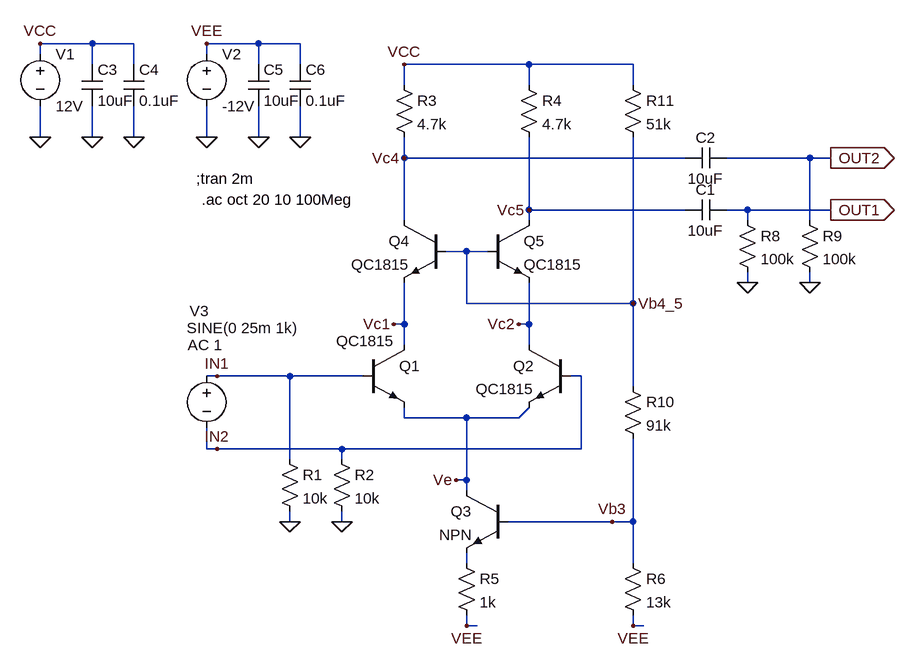
[diagram p0: schematic Diff_Amp_2SC1815_Cascode.asc]
Diff_Amp_2SC1815_Cascode.asc, the LTspice schematic file:
Version 4
SHEET 1 1076 680
WIRE -320 -352 -400 -352
WIRE -256 -352 -320 -352
WIRE -64 -352 -144 -352
WIRE 0 -352 -64 -352
WIRE -400 -336 -400 -352
WIRE -144 -336 -144 -352
WIRE -320 -320 -320 -352
WIRE -256 -320 -256 -352
WIRE -64 -320 -64 -352
WIRE 0 -320 0 -352
WIRE 352 -320 160 -320
WIRE 512 -320 352 -320
WIRE 160 -288 160 -320
WIRE 352 -288 352 -320
WIRE 512 -288 512 -320
WIRE -400 -208 -400 -256
WIRE -320 -208 -320 -256
WIRE -256 -208 -256 -256
WIRE -144 -208 -144 -256
WIRE -64 -208 -64 -256
WIRE 0 -208 0 -256
WIRE 160 -176 160 -208
WIRE 592 -176 160 -176
WIRE 784 -176 656 -176
WIRE 816 -176 784 -176
WIRE 352 -96 352 -208
WIRE 592 -96 352 -96
WIRE 688 -96 656 -96
WIRE 816 -96 688 -96
WIRE 160 -80 160 -176
WIRE 352 -80 352 -96
WIRE 688 -80 688 -96
WIRE 784 -80 784 -176
WIRE 256 -32 224 -32
WIRE 288 -32 256 -32
WIRE 688 16 688 0
WIRE 784 16 784 0
WIRE 256 48 256 -32
WIRE 512 48 512 -208
WIRE 512 48 256 48
WIRE 160 80 160 16
WIRE 160 80 144 80
WIRE 352 80 352 16
WIRE 352 80 336 80
WIRE 160 112 160 80
WIRE 352 112 352 80
WIRE -128 160 -144 160
WIRE -16 160 -128 160
WIRE 96 160 -16 160
WIRE 432 160 416 160
WIRE 512 176 512 48
WIRE 160 224 160 208
WIRE 256 224 160 224
WIRE 336 224 352 208
WIRE 336 224 256 224
WIRE -144 272 -144 240
WIRE -128 272 -144 272
WIRE 64 272 -128 272
WIRE 432 272 432 160
WIRE 432 272 64 272
WIRE -16 288 -16 160
WIRE 64 288 64 272
WIRE 256 320 256 224
WIRE 256 320 240 320
WIRE 256 336 256 320
WIRE -16 384 -16 368
WIRE 64 384 64 368
WIRE 480 384 320 384
WIRE 512 384 512 256
WIRE 512 384 480 384
WIRE 256 448 256 432
WIRE 512 448 512 384
WIRE 256 544 256 528
WIRE 272 544 256 544
WIRE 512 544 512 528
WIRE 528 544 512 544
FLAG -16 384 0
FLAG 64 384 0
FLAG 160 -320 VCC
FLAG 256 544 VEE
FLAG 512 544 VEE
FLAG 688 16 0
FLAG 784 16 0
FLAG 816 -96 OUT1
IOPIN 816 -96 Out
FLAG 816 -176 OUT2
IOPIN 816 -176 Out
FLAG -400 -208 0
FLAG -144 -208 0
FLAG -400 -352 VCC
FLAG -144 -352 VEE
FLAG -128 160 IN1
FLAG -128 272 IN2
FLAG 480 384 Vb3
FLAG 240 320 Ve
FLAG 144 80 Vc1
FLAG 336 80 Vc2
FLAG -320 -208 0
FLAG -256 -208 0
FLAG -64 -208 0
FLAG 0 -208 0
FLAG 512 48 Vb4_5
FLAG 160 -176 Vc4
FLAG 352 -96 Vc5
SYMBOL npn 96 112 R0
WINDOW 3 -41 -6 Left 2
SYMATTR Value QC1815
SYMATTR InstName Q1
SYMBOL npn 416 112 M0
SYMATTR InstName Q2
SYMATTR Value QC1815
SYMBOL npn 320 336 M0
SYMATTR InstName Q3
SYMBOL res -32 272 R0
SYMATTR InstName R1
SYMATTR Value 10k
SYMBOL res 48 272 R0
SYMATTR InstName R2
SYMATTR Value 10k
SYMBOL res 144 -304 R0
SYMATTR InstName R3
SYMATTR Value 4.7k
SYMBOL res 336 -304 R0
SYMATTR InstName R4
SYMATTR Value 4.7k
SYMBOL cap 656 -112 R90
WINDOW 0 0 32 VBottom 2
WINDOW 3 32 32 VTop 2
SYMATTR InstName C1
SYMATTR Value 10uF
SYMBOL cap 656 -192 R90
WINDOW 0 0 32 VBottom 2
WINDOW 3 32 32 VTop 2
SYMATTR InstName C2
SYMATTR Value 10uF
SYMBOL res 240 432 R0
SYMATTR InstName R5
SYMATTR Value 1k
SYMBOL res 496 432 R0
SYMATTR InstName R6
SYMATTR Value 13k
SYMBOL res 672 -96 R0
SYMATTR InstName R8
SYMATTR Value 100k
SYMBOL res 768 -96 R0
SYMATTR InstName R9
SYMATTR Value 100k
SYMBOL voltage -400 -352 R0
WINDOW 123 0 0 Left 2
WINDOW 39 0 0 Left 2
SYMATTR InstName V1
SYMATTR Value 12V
SYMBOL voltage -144 -352 R0
WINDOW 123 0 0 Left 2
WINDOW 39 0 0 Left 2
SYMATTR InstName V2
SYMATTR Value -12V
SYMBOL voltage -144 144 R0
WINDOW 0 -26 -84 Left 2
WINDOW 3 -31 -58 Left 2
WINDOW 123 -29 -32 Left 2
WINDOW 39 0 0 Left 2
SYMATTR InstName V3
SYMATTR Value SINE(0 25m 1k)
SYMATTR Value2 AC 1
SYMBOL npn 224 -80 M0
SYMATTR InstName Q4
SYMATTR Value QC1815
SYMBOL npn 288 -80 R0
SYMATTR InstName Q5
SYMATTR Value QC1815
SYMBOL res 496 160 R0
SYMATTR InstName R10
SYMATTR Value 91k
SYMBOL res 496 -304 R0
SYMATTR InstName R11
SYMATTR Value 51k
SYMBOL cap -336 -320 R0
SYMATTR InstName C3
SYMATTR Value 10uF
SYMBOL cap -272 -320 R0
SYMATTR InstName C4
SYMATTR Value 0.1uF
SYMBOL cap -80 -320 R0
SYMATTR InstName C5
SYMATTR Value 10uF
SYMBOL cap -16 -320 R0
SYMATTR InstName C6
SYMATTR Value 0.1uF
TEXT -160 -144 Left 2 !;tran 2m
TEXT -152 -112 Left 2 !.ac oct 20 10 100Meg

The netlist it stands for:
* Diff_Amp_2SC1815_Cascode.asc
Q1 Vc1 IN1 Ve 0 QC1815
Q2 Vc2 IN2 Ve 0 QC1815
Q3 Ve Vb3 N001 0 NPN
R1 IN1 0 10k
R2 IN2 0 10k
R3 VCC Vc4 4.7k
R4 VCC Vc5 4.7k
C1 OUT1 Vc5 10uF
C2 OUT2 Vc4 10uF
R5 N001 VEE 1k
R6 Vb3 VEE 13k
R8 OUT1 0 100k
R9 OUT2 0 100k
V1 VCC 0 12V
V2 VEE 0 -12V
V3 IN1 IN2 SINE(0 25m 1k) AC 1
Q4 Vc4 Vb4_5 Vc1 0 QC1815
Q5 Vc5 Vb4_5 Vc2 0 QC1815
R10 Vb4_5 Vb3 91k
R11 VCC Vb4_5 51k
C3 VCC 0 10uF
C4 VCC 0 0.1uF
C5 VEE 0 10uF
C6 VEE 0 0.1uF
.model NPN NPN
.model PNP PNP
.lib standard.bjt
;tran 2m
.ac oct 20 10 100Meg
.backanno
.end